# EAGLE design OSRR-v3 (EAGLE 9.3.1)

## Sheet 1 of 4: LCD/MCU
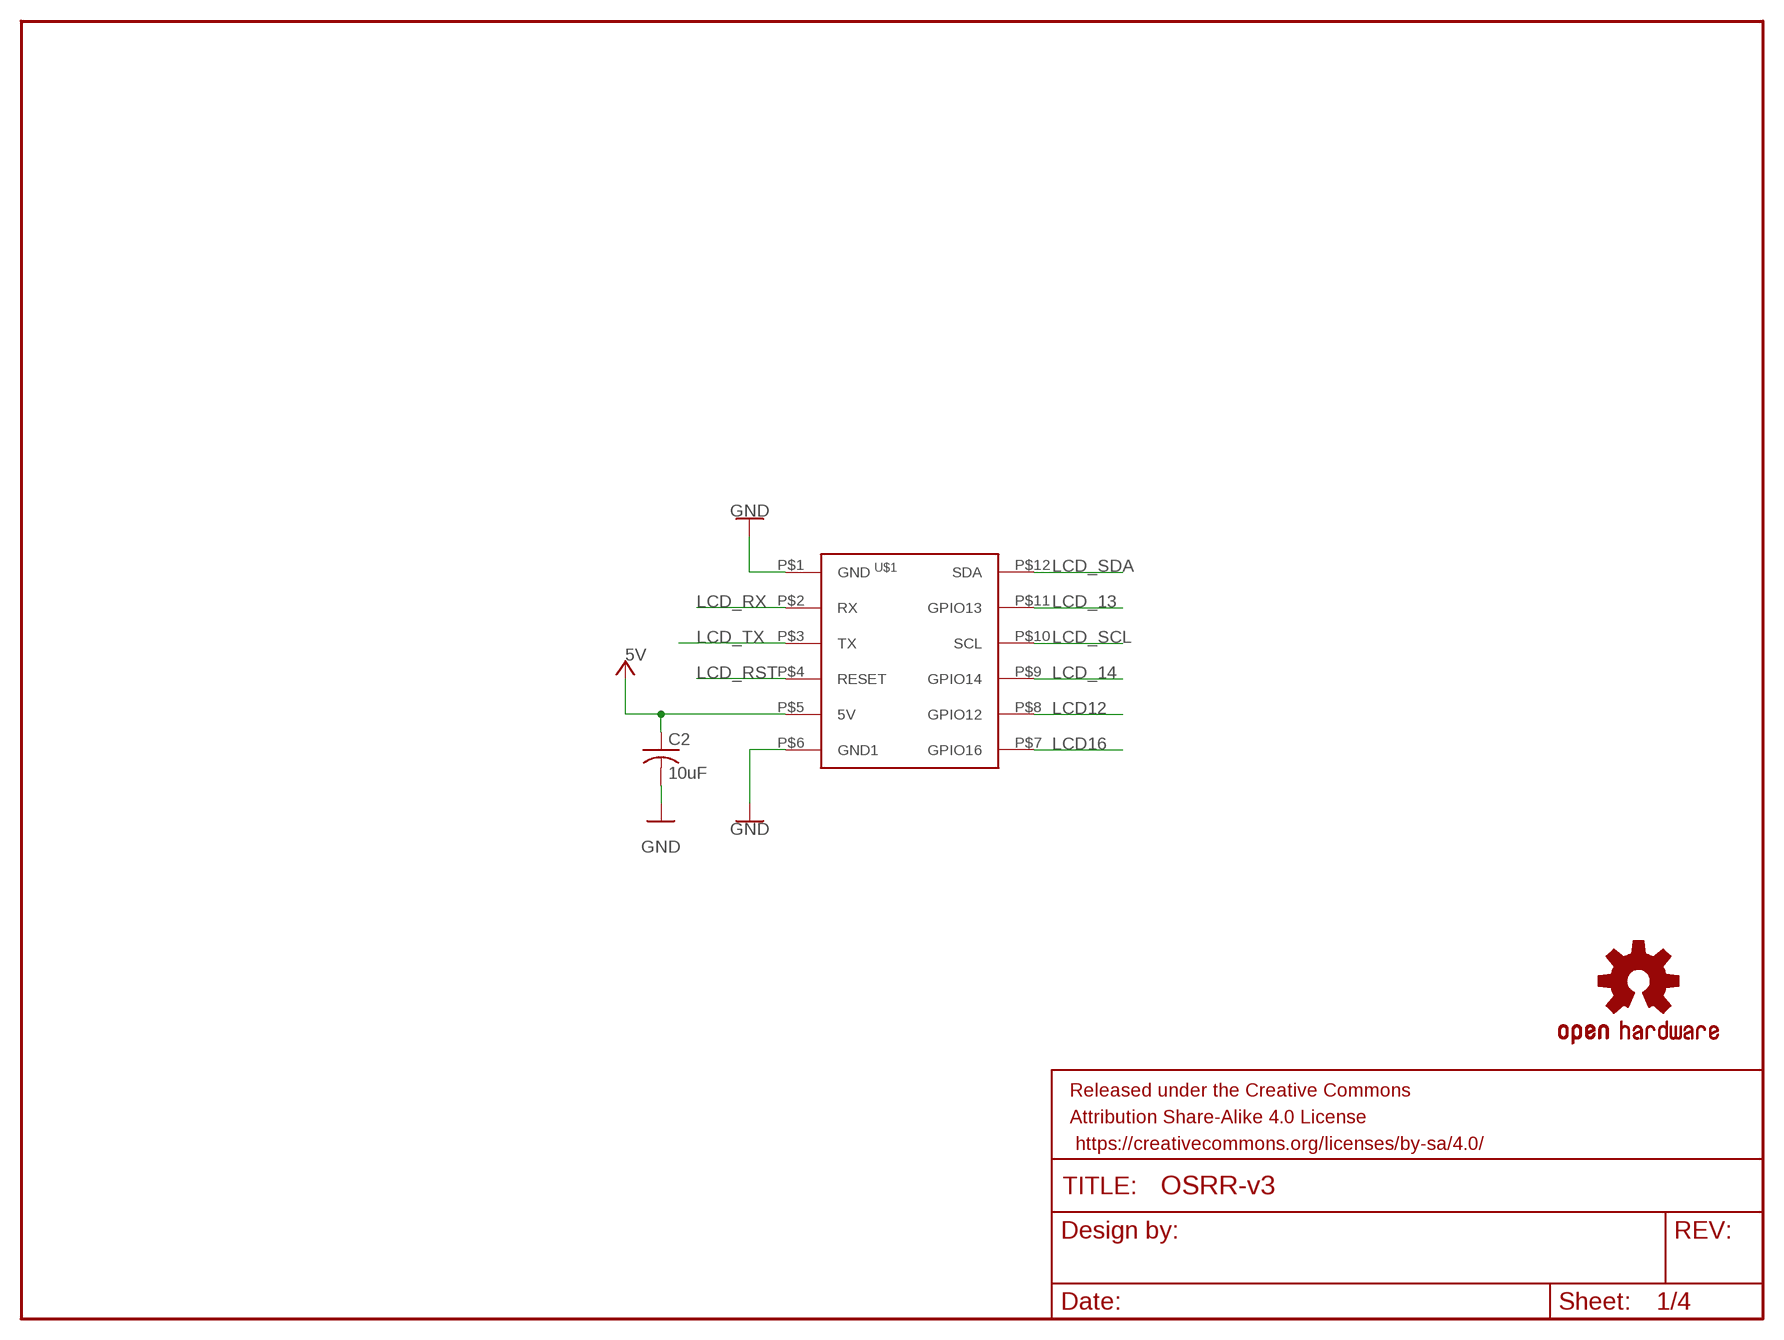
[diagram p0: schematic, sheet 1]

### Parts
C2  10uF  C-USC0603  [C0603]
FRAME1  FRAME-LETTER  [CREATIVE_COMMONS]
LOGO1  OSHW-LOGOS  [OSHW-LOGO-S]
U$1  IOD-09  [IOD-9TH]

### Nets
5V: C2.1 U$1.P$5(5V) ; supply symbol labelled +5V ; also sheet 3,4
GND: C2.2 U$1.P$1(GND) U$1.P$6(GND1) ; also sheet 2,3,4
LCD12: U$1.P$8(GPIO12)
LCD16: U$1.P$7(GPIO16)
LCD_13: U$1.P$11(GPIO13)
LCD_14: U$1.P$9(GPIO14)
LCD_RST: U$1.P$4(RESET)
LCD_RX: U$1.P$2(RX) ; also sheet 2
LCD_SCL: U$1.P$10(SCL) ; also sheet 3
LCD_SDA: U$1.P$12(SDA) ; also sheet 3
LCD_TX: U$1.P$3(TX) ; also sheet 2

## Sheet 2 of 4: XBEE RADIO
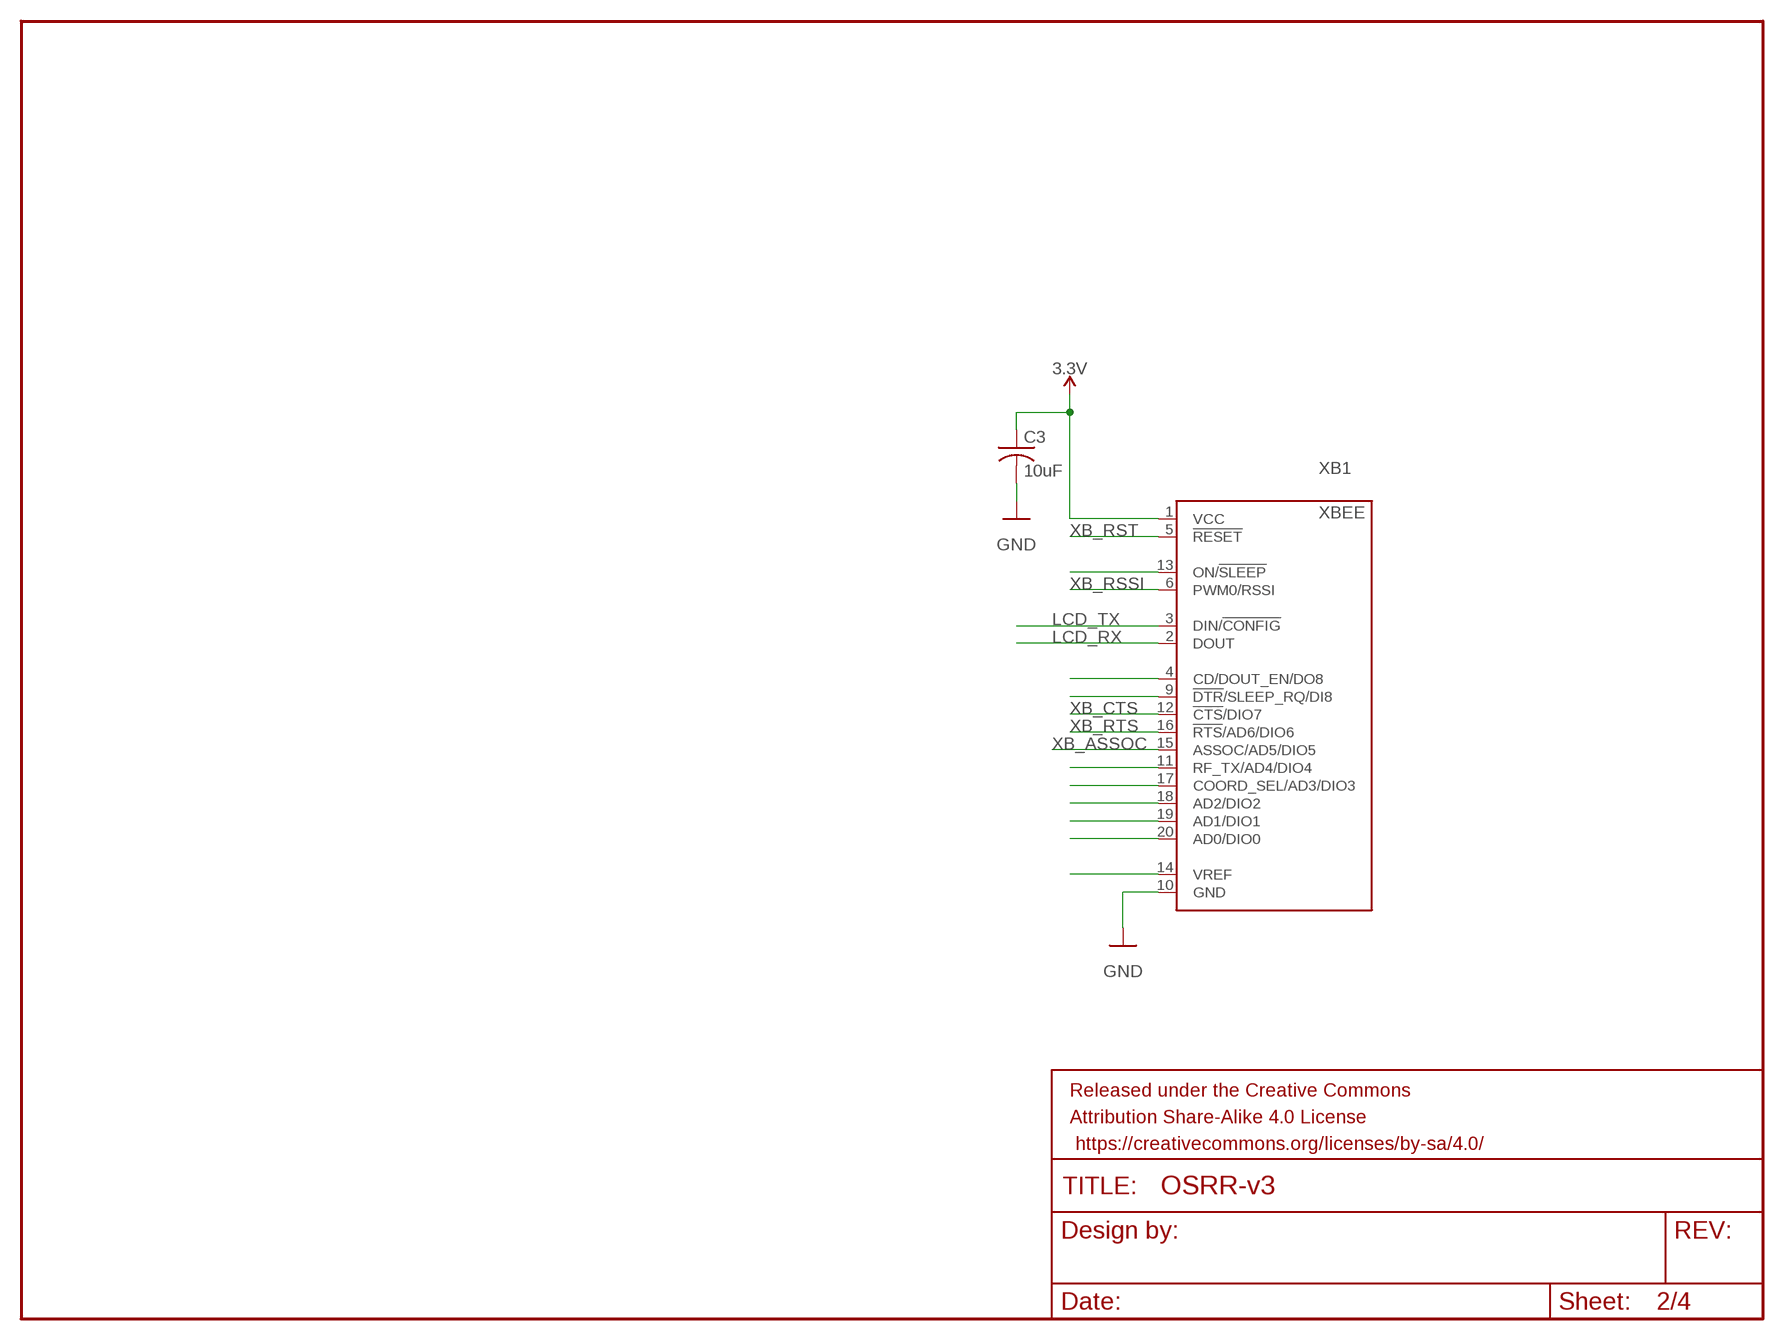
[diagram p1: schematic, sheet 2]

### Parts
C3  10uF  C-USC0603  [C0603]
FRAME2  FRAME-LETTER  [CREATIVE_COMMONS]
XB1  XBEE  [XBEE]

### Nets
3.3V: C3.1 XB1.1(VCC) ; also sheet 4
GND: C3.2 XB1.10(GND) ; also sheet 1,3,4
LCD_RX: XB1.2(DOUT) ; also sheet 1
LCD_TX: XB1.3(DIN/!CONFIG) ; also sheet 1
N$1: XB1.4(CD/DOUT_EN/DO8)
N$2: XB1.9(!DTR!/SLEEP_RQ/DI8)
N$6: XB1.13(ON/!SLEEP)
N$25: XB1.11(RF_TX/AD4/DIO4)
N$26: XB1.17(COORD_SEL/AD3/DIO3)
N$27: XB1.18(AD2/DIO2)
N$28: XB1.19(AD1/DIO1)
N$29: XB1.20(AD0/DIO0)
N$30: XB1.14(VREF)
XB_ASSOC: XB1.15(ASSOC/AD5/DIO5)
XB_CTS: XB1.12(!CTS!/DIO7)
XB_RSSI: XB1.6(PWM0/RSSI) ; also sheet 3
XB_RST: XB1.5(!RESET)
XB_RTS: XB1.16(!RTS!/AD6/DIO6)

## Sheet 3 of 4: ADC INPUT
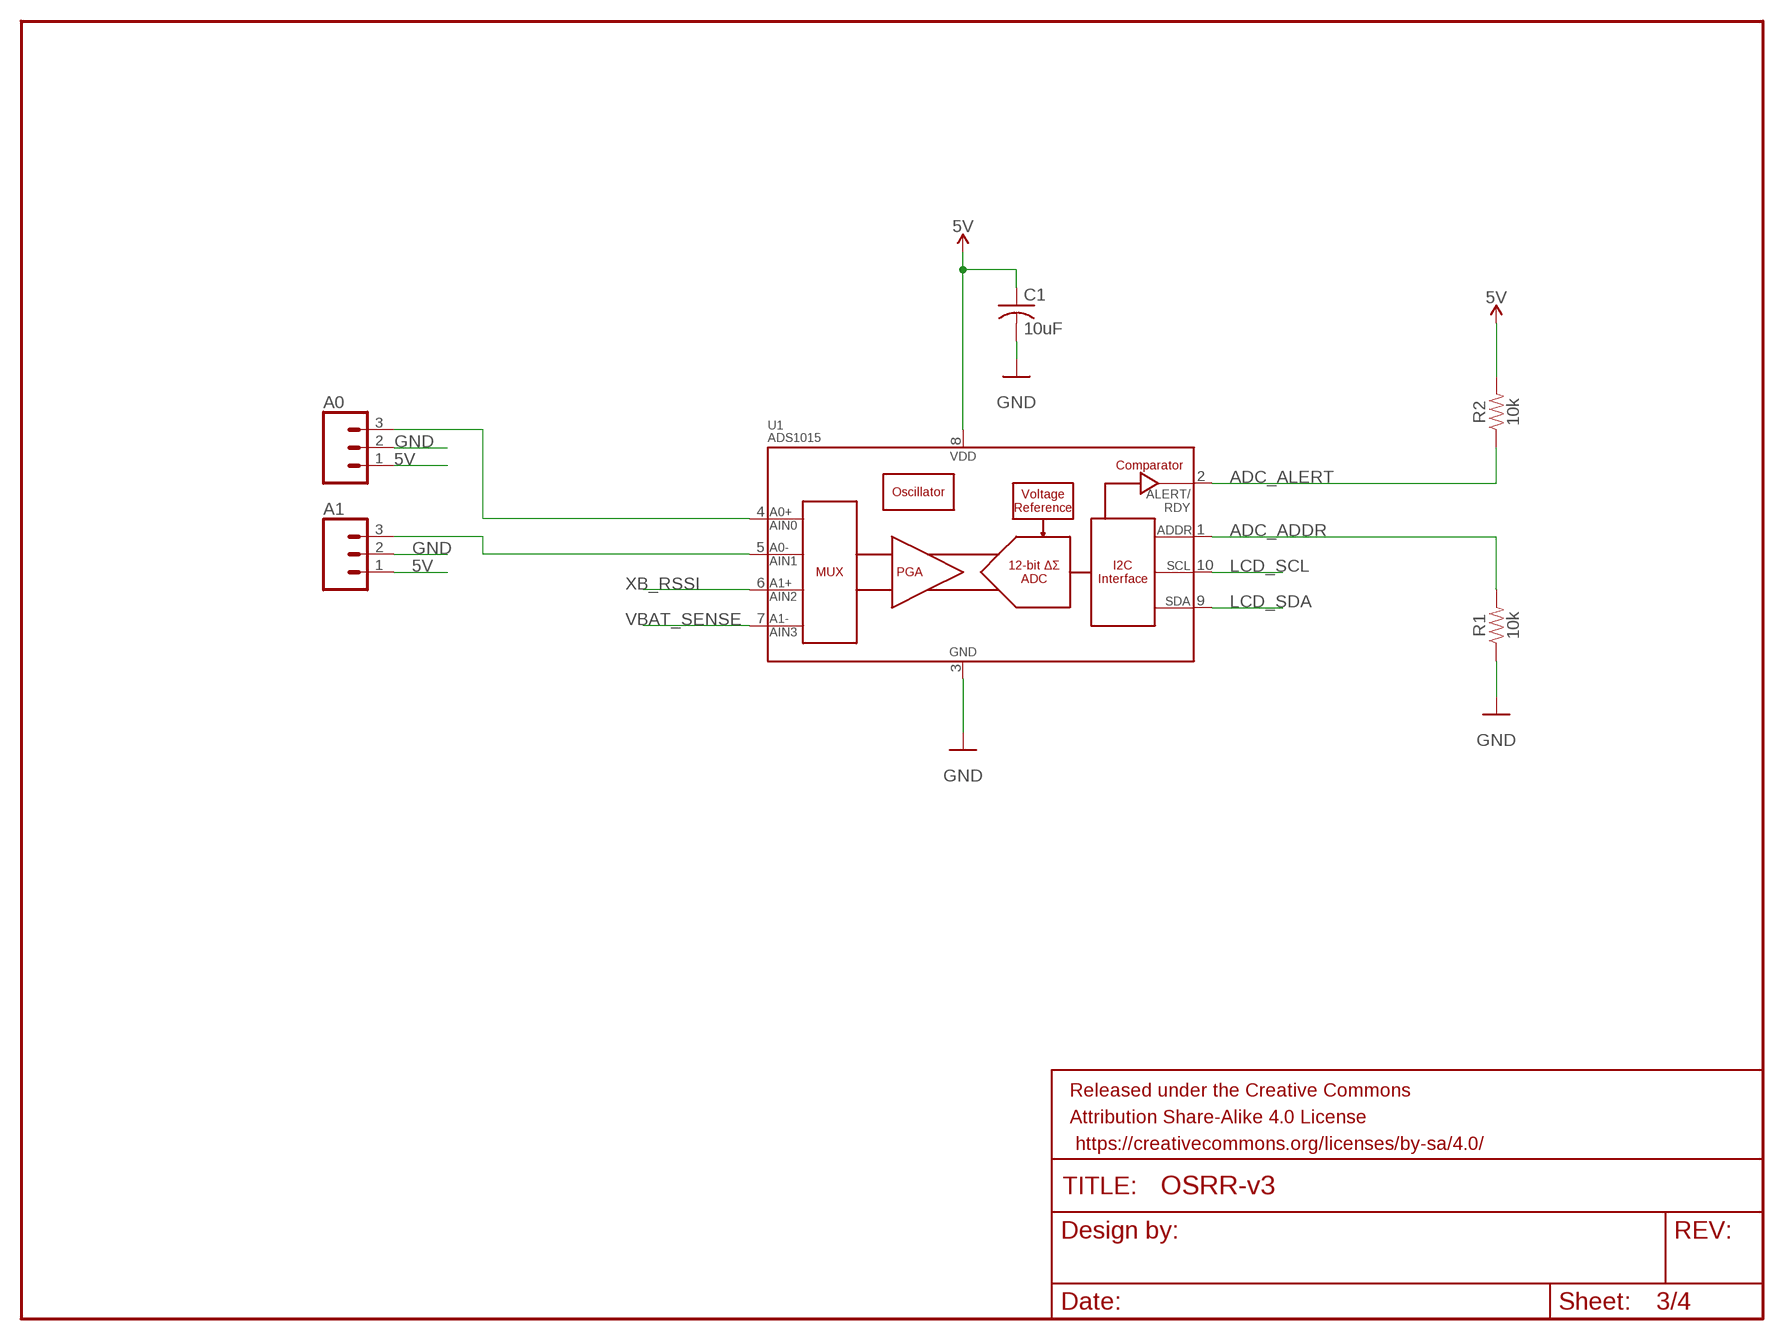
[diagram p2: schematic, sheet 3]

### Parts
A0  CONN_03JST-PTH-VERT  [JST-3-PTH-VERT]
A1  CONN_03JST-PTH-VERT  [JST-3-PTH-VERT]
C1  10uF  C-USC0603  [C0603]
FRAME3  FRAME-LETTER  [CREATIVE_COMMONS]
R1  10k  10KOHM-0603-1/10W-1%  [0603]
R2  10k  10KOHM-0603-1/10W-1%  [0603]
U1  ADS1015  [MSOP10]

### Nets
5V: A0.1 A1.1 C1.1 R2.2 U1.8(VDD) ; also sheet 1,4
ADC_ADDR: R1.2 U1.1(ADDR)
ADC_ALERT: R2.1 U1.2(ALERT/RDY)
GND: A0.2 A1.2 C1.2 R1.1 U1.3(VSS) ; also sheet 1,2,4
LCD_SCL: U1.10(SCL) ; also sheet 1
LCD_SDA: U1.9(SDA) ; also sheet 1
N$9: A0.3 U1.4(AIN0)
N$10: A1.3 U1.5(AIN1)
VBAT_SENSE: U1.7(AIN3) ; also sheet 4
XB_RSSI: U1.6(AIN2) ; also sheet 2

## Sheet 4 of 4: POWER
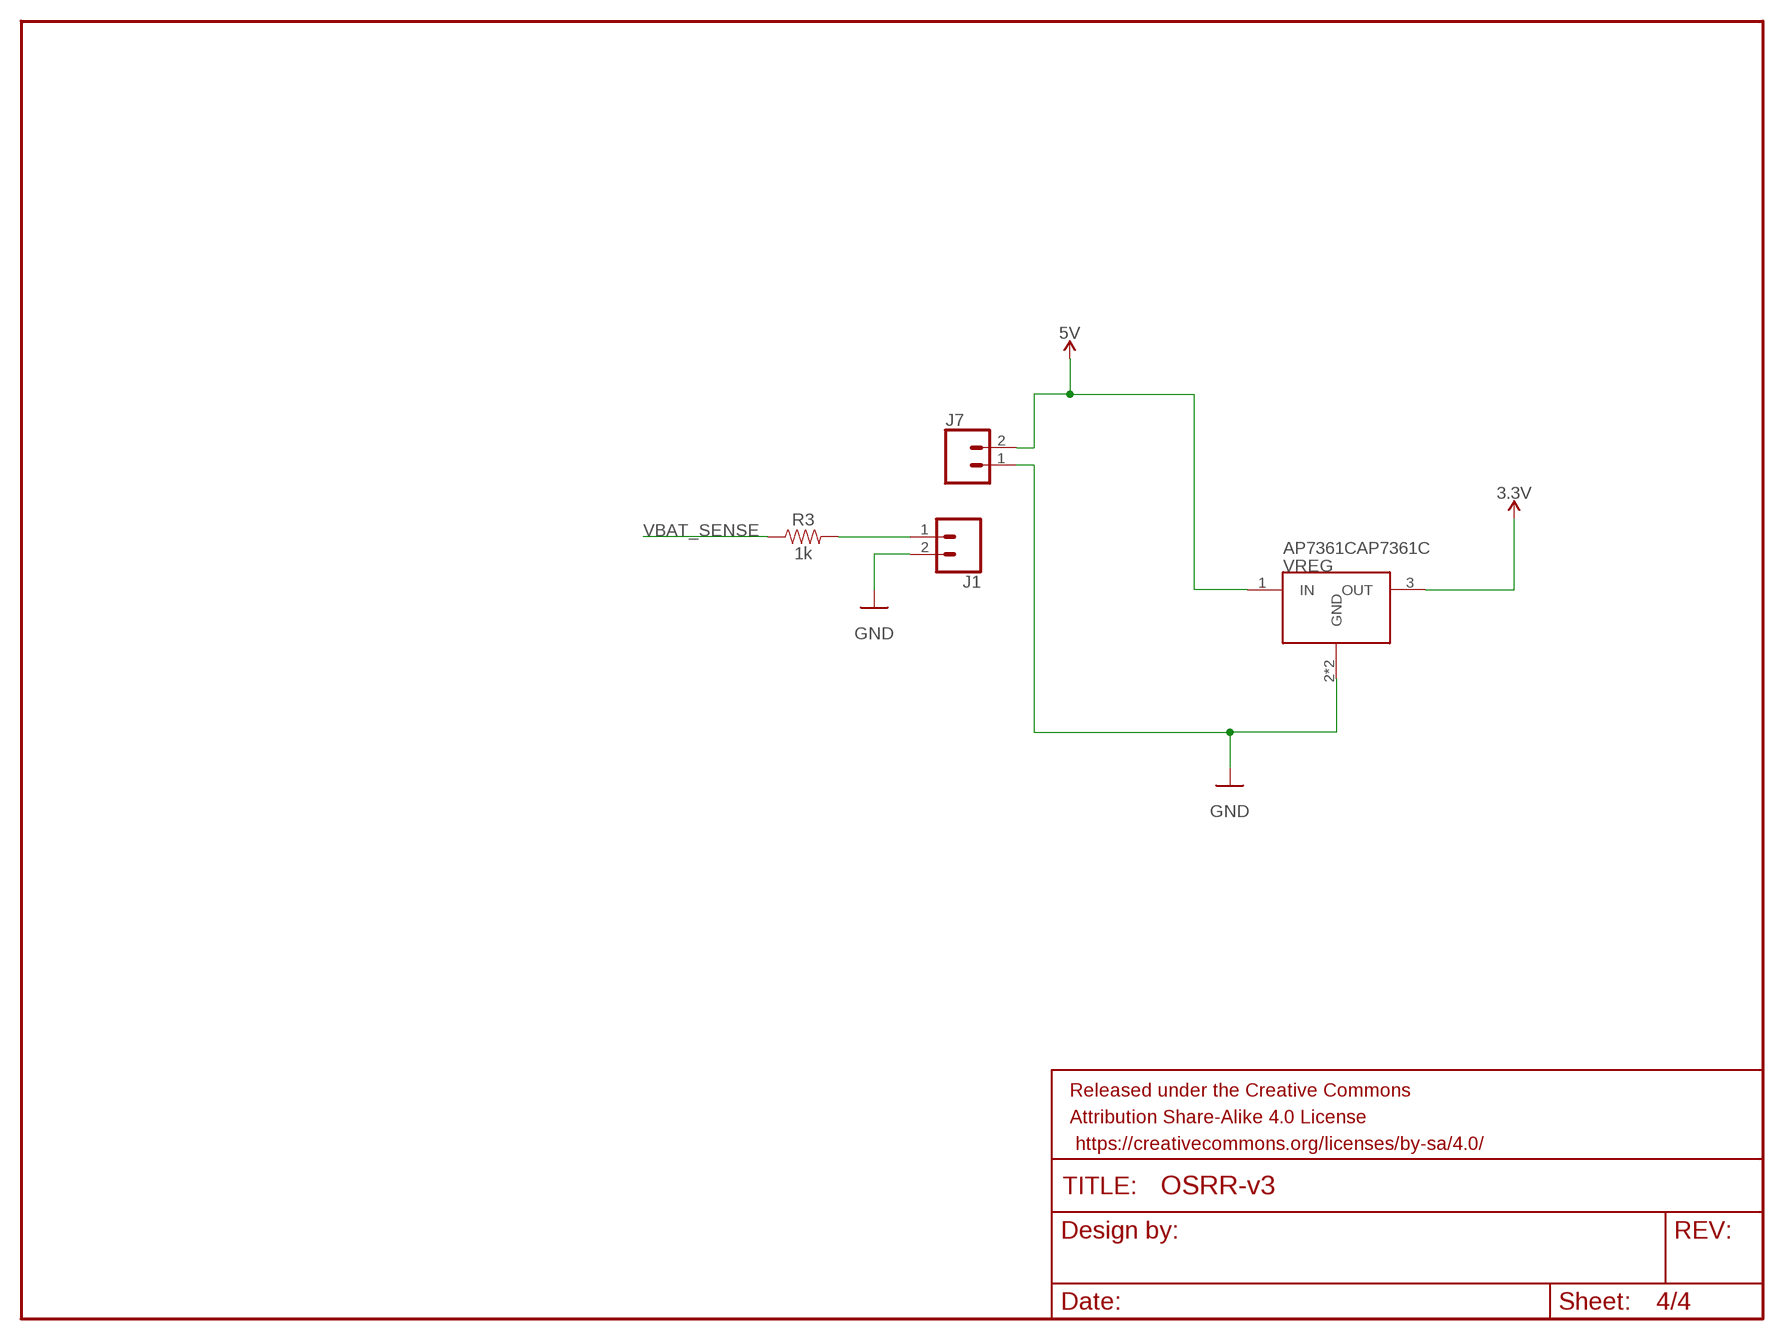
[diagram p3: schematic, sheet 4]

### Parts
FRAME4  FRAME-LETTER  [CREATIVE_COMMONS]
J1  CONN_02  [1X02]
J7  CONN_02-JST-2-PTH-NO_SILK  [JST-2-PTH-NS]
R3  1k  1KOHM-0603-1/10W-1%  [0603]
VREG  AP7361CAP7361C  [SOT230P700X180-4]

### Nets
3.3V: VREG.3(OUT) ; also sheet 2
5V: J7.2 VREG.1(IN) ; also sheet 1,3
GND: J1.2 J7.1 VREG.2(GND) VREG.4(GND) ; also sheet 1,2,3
N$3: J1.1 R3.2
VBAT_SENSE: R3.1 ; also sheet 3

## Library data of the parts
A0 A1 = SparkFun-Connectors:CONN_03: Multi connection point. Often used as Generic Header-pin footprint for 0.1 inch spaced/style header connections On any of the 0.1 inch spaced packages, you can populate with these: Break Away Headers - Straight <https://www.sparkfun.com/products/116> (PRT-00116) Break Away Male Headers - Right Angle <https://www.sparkfun.com/products/553> (PRT-00553) Female Headers <https://www.sparkfun.com/products/115> (PRT-00115) Break Away Headers - Machine Pin <https://www.sparkfun.com/products/117> (PRT-00117) Break Away Female Headers - Swiss Machine Pin <https://www.sparkfun.com/products/743> (PRT-00743) Stackable Header - 3 Pin (Female, 0.1") <https://www.sparkfun.com/products/13875> (PRT-13875) For SCREWTERMINALS and SPRING TERMINALS visit here: Screw Terimnals on SparkFun.com <https://www.sparkfun.com/search/results?term=Screw+Terminals> (5mm/3.5mm/2.54mm spacing) This device is also useful as a general connection point to wire up your design to another part of your project. Our various solder wires solder well into these plated through hole pads. Hook-Up Wire - Assortment (Stranded, 22 AWG) <https://www.sparkfun.com/products/11375> (PRT-11375) Hook-Up Wire - Assortment (Solid Core, 22 AWG) <https://www.sparkfun.com/products/11367> (PRT-11367) View the entire wire category on our website here <https://www.sparkfun.com/categories/141> Special notes: Molex polarized connector foot print use with SKU : PRT-08232 with associated crimp pins and housings.; PROD_ID: CONN-13230
C1-C3 = adafruit:C-US: CAPACITOR, American symbol
FRAME1-FRAME4 = SparkFun-Aesthetics:FRAME-LETTER: Schematic Frame - Letter Standard 8.5x11 US Letter frame
J1 J7 = SparkFun-Connectors:CONN_02: Multi connection point. Often used as Generic Header-pin footprint for 0.1 inch spaced/style header connections On any of the 0.1 inch spaced packages, you can populate with these: Break Away Headers - Straight <https://www.sparkfun.com/products/116> (PRT-00116) Break Away Male Headers - Right Angle <https://www.sparkfun.com/products/553> (PRT-00553) Female Headers <https://www.sparkfun.com/products/115> (PRT-00115) Break Away Headers - Machine Pin <https://www.sparkfun.com/products/117> (PRT-00117) Break Away Female Headers - Swiss Machine Pin <https://www.sparkfun.com/products/743> (PRT-00743) For SCREWTERMINALS and SPRING TERMINALS visit here: Screw Terimnals on SparkFun.com <https://www.sparkfun.com/search/results?term=Screw+Terminals> (5mm/3.5mm/2.54mm spacing) This device is also useful as a general connection point to wire up your design to another part of your project. Our various solder wires solder well into these plated through hole pads. Hook-Up Wire - Assortment (Stranded, 22 AWG) <https://www.sparkfun.com/products/11375> (PRT-11375) Hook-Up Wire - Assortment (Solid Core, 22 AWG) <https://www.sparkfun.com/products/11367> (PRT-11367) View the entire wire category on our website here <https://www.sparkfun.com/categories/141> Special notes: Molex polarized connector foot print use with: PRT-08233 with associated crimp pins and housings. 2.54_SCREWTERM for use with PRT-10571. 3.5mm Screw Terminal footprints for PRT-08084 5mm Screw Terminal footprints for use with PRT-08432
LOGO1 = SparkFun-Aesthetics:OSHW-LOGO: Open-Source Hardware (OSHW) Logo This logo indicates the piece of hardware it is found on incorporates a OSHW license and/or adheres to the definition of open source hardware found here: http://freedomdefined.org/OSHW
R1 R2 = SparkFun-Resistors:10KOHM: 10kΩ resistor A resistor is a passive two-terminal electrical component that implements electrical resistance as a circuit element. Resistors act to reduce current flow, and, at the same time, act to lower voltage levels within circuits. - Wikipedia; PROD_ID: RES-00824
R3 = SparkFun-Resistors:1KOHM: 1kΩ resistor A resistor is a passive two-terminal electrical component that implements electrical resistance as a circuit element. Resistors act to reduce current flow, and, at the same time, act to lower voltage levels within circuits. - Wikipedia; PROD_ID: RES-07856
U1 = SparkFun-IC-Conversion:ADS1015: ADS1015 12-BIT ADC 12-Bit Del-Sig ADC Four single-ended inputs or two differential inputs Internal PGA I2C interface 2.0-5.5V SparkFun Products SparkFun Block for Intel Edison - ADC <https://www.sparkfun.com/products/13770> (DEV-13770); PROD_ID: IC-12270
U$1 = lo3energy:IOD-09
VREG = lo3energy:AP7361C
XB1 = arbotixM_revC:XBEE: XBee (TM) /XBee-PRO(TM) OEM RF Modules Source: MaxStream, Inc. xbee_productmanual.pdf; MPN: XBP24-Z7UIT-004; OC_FARNELL: 1751799; OC_NEWARK: 34R5507

## Board
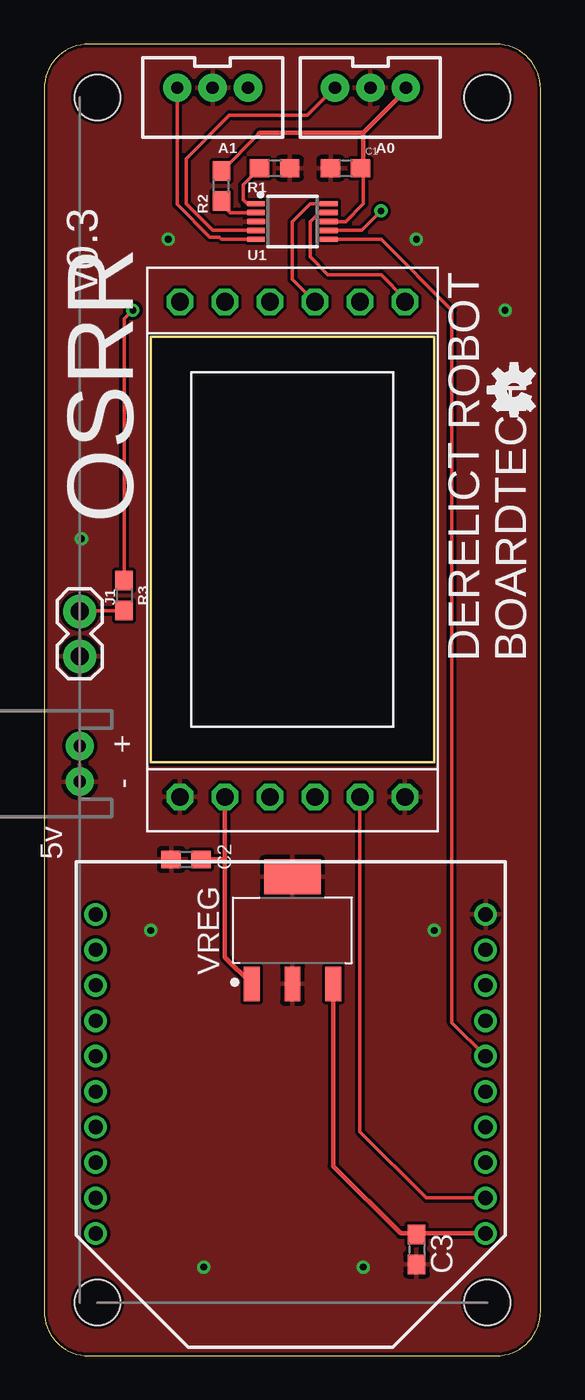
[diagram p4: board, top side]
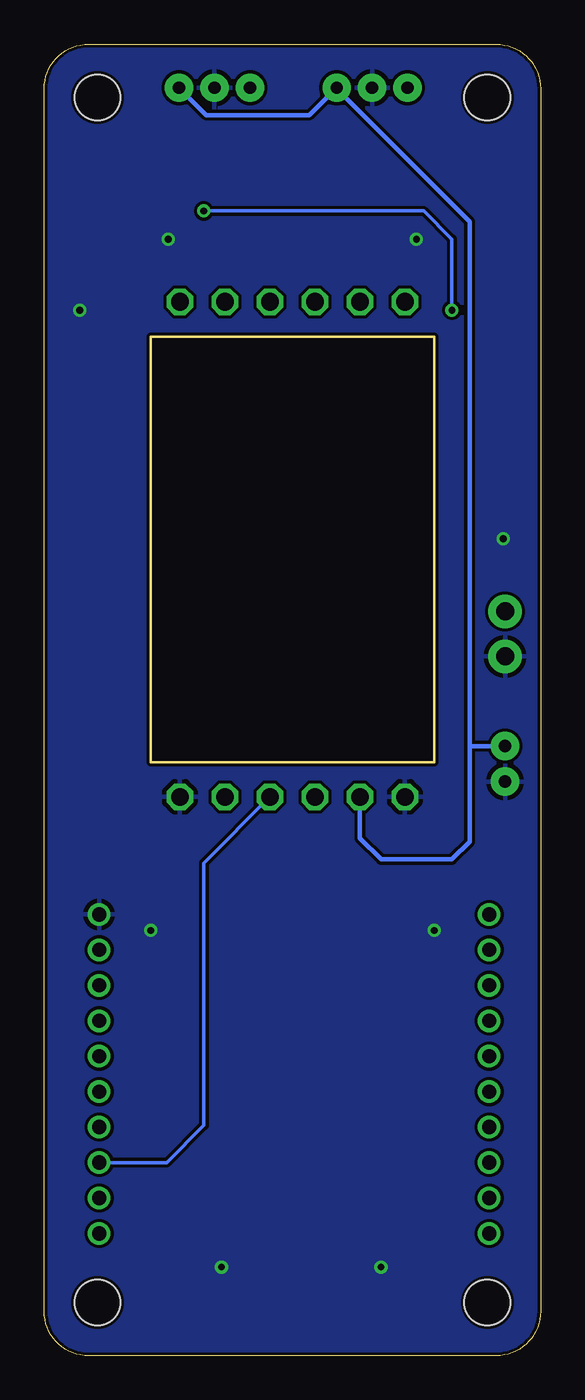
[diagram p5: board, bottom side, seen from below]

Size 28 x 74 mm. Coordinates in mm from the lower left corner, seen from the top.
Outline: 0,71.5 0,2.5 arc90 2.5,0 25.5,0 arc90 28,2.5 28,71.5 arc90 25.5,74 2.5,74 arc90 0,71.5
Copper layers (1*16): Top 0.035mm / dielectric 1.5mm / Bottom 0.035mm
Design rules "SparkFun-2-layer-TIGHT": minimum track width 7mil, minimum drill 15mil, track to track 7mil, track to pad 7mil, pad to pad 7mil, via to via 7mil, smd to smd 7mil, copper to edge 7mil, drill to drill 7mil, minimum pad ring 7mil, minimum via ring 7mil, stop-mask expansion 4mil, vias tented up to drill 25mil, thermal gap 10mil
Holes 2.6 mm at 3,3 25,3 3,71 25,71

### Footprints (pad centres in the part's own frame; a part is rotated, then mirrored left to right if it is on the bottom)
JST-3-PTH-VERT = drill 0.7 pad 1.6: 1 -2,-0.55; 2 0,-0.55; 3 2,-0.55
C0603 = smd 1.1 x 1: 1 -0.85,0; 2 0.85,0
1X02 = drill 1.016 pad 1.88: 1 0,0; 2 2.54,0
JST-2-PTH-NS = drill 0.7 pad 1.6: 1 -1,0; 2 1,0
0603 = smd 1.1 x 1: 1 -0.85,0; 2 0.85,0
MSOP10 = smd 0.3 x 1: 1 -1,-2.05; 2 -0.5,-2.05; 3 0,-2.05; 4 0.5,-2.05; 5 1,-2.05; 6 1,2.05; 7 0.5,2.05; 8 0,2.05; 9 -0.5,2.05; 10 -1,2.05
IOD-9TH = drill 1 octagon: P$1 -6.35,13.97; P$2 -3.81,13.97; P$3 -1.27,13.97; P$4 1.27,13.97; P$5 3.81,13.97; P$6 6.35,13.97; P$7 6.35,-13.97; P$8 3.81,-13.97; P$9 1.27,-13.97; P$10 -1.27,-13.97; P$11 -3.81,-13.97; P$12 -6.35,-13.97
SOT230P700X180-4 = smd 1.965 x 0.889: 1 -3.023,2.3; 2 -3.023,0; 3 -3.023,-2.3 | smd 1.965 x 3.189: 4 3.023,0
XBEE = drill 0.8 pad 1.27: 1 -11,9; 2 -11,7; 3 -11,5; 4 -11,3; 5 -11,1; 6 -11,-1; 7 -11,-3; 8 -11,-5; 9 -11,-7; 10 -11,-9; 11 11,-9; 12 11,-7; 13 11,-5; 14 11,-3; 15 11,-1; 16 11,1; 17 11,3; 18 11,5; 19 11,7; 20 11,9

### Placement (x,y rotation side)
A0  18.4,71 180 top
A1  9.5,71 180 top
C1  17,67 180 top
C2  8,28 180 top
C3  21,6 270 top
FRAME1  -18,-44 0 top  (outside the outline)
FRAME2  -18,-53 0 top  (outside the outline)
FRAME3  -18,-62 0 top  (outside the outline)
FRAME4  -18,-71 0 top  (outside the outline)
J1  2,42 270 top
J7  2,33.4 90 top
LOGO1  26.5,54.5 90 top
R1  13,67 180 top
R2  10,66 90 top
R3  4.5,42.9 270 top
U1  14,64 270 top
U$1  14,45.5 180 top
VREG  14,24 90 top
XB1  13.9,15.9 180 top

### Tracks (layer width: path | path; a pad name or v marks a point on that pad's centre or on a via)
3.3V
  Top 0.254: VREG.3 16.3,10.7 20.1,6.9 20.95,6.9 | 20.95,6.9 XB1.1 | C3.1 20.95,6.9
5V
  Top 0.2: 18,66.85 18,65 17,64 U1.8 | R2.2 12.07,68.92
  Top 0.254: U$1.P$5 10.19,28 | 10.19,28 10.19,22.49 VREG.1 | 18,66.85 C1.1 18,67.15 18,69 | C2.1 10.19,28 | 12.07,68.92 12.15,69 18,69 | 18,69 20.4,71.4 A0.1
  Bottom 0.254: U$1.P$5 10.19,29.19 9,28 5,28 4,29 4,34.4 | 4,34.4 4,64 11.5,71.5 A1.1 13.05,70 18.85,70 A0.1 | J7.2 4,34.4
ADC_ADDR
  Top 0.2: U1.1 11.44,65 11.22,65.22 11.22,66.07 R1.2
ADC_ALERT
  Top 0.2: U1.2 10.5,64.5 10,65 R2.1
GND  (via drill 0.38)
  other vias: 7,63 21,63 26,59 2.1,46.1 6,24 22,24 18,5 9,5
  pour Bottom: -2,77 30,77 30,-1 -3,-1 -3,77
  pour Top: -3,77 30,77 30,-1 -3,-1
LCD_RX
  Top 0.2: XB1.2 21.56,8.9 17.81,12.65 U$1.P$2
LCD_SCL
  Top 0.2: U1.10 15,65 14,64 14,60.74 U$1.P$10
LCD_SDA
  Top 0.2: U$1.P$12 20.35,59.65 19,61 16,61 15,62 15,63.99 15.51,64.5 U1.9
LCD_TX
  Bottom 0.2: XB1.3 21.1,10.9 19,13 19,27.8 U$1.P$3
N$3
  Top 0.2: J1.1 2.05,42.05 R3.2
N$9
  Top 0.2: U1.4 9.5,63.5 8,65 8,67.55 10.45,70 14.85,70 A0.3
N$10
  Top 0.2: U1.5 10,63 9.88,63.12 9.34,63.12 7.5,64.97 A1.3
VBAT_SENSE  (via drill 0.38)
  Top 0.2: U1.7 17.9,63.5 v19,64.6 | R3.1 4.5,58.5 v5,59
  Bottom 0.2: v19,64.6 6.6,64.6 5,63 v5,59
XB_RSSI
  Top 0.2: U1.6 19,63 23,59 23,18.8 XB1.6

### Text on the board
tPlace: v0.3 | OSRR | DERELICT ROBOT / BOARDTECH | + | - | 5v